# EAGLE schematic shige7seg_earring (EAGLE 9.4.1)
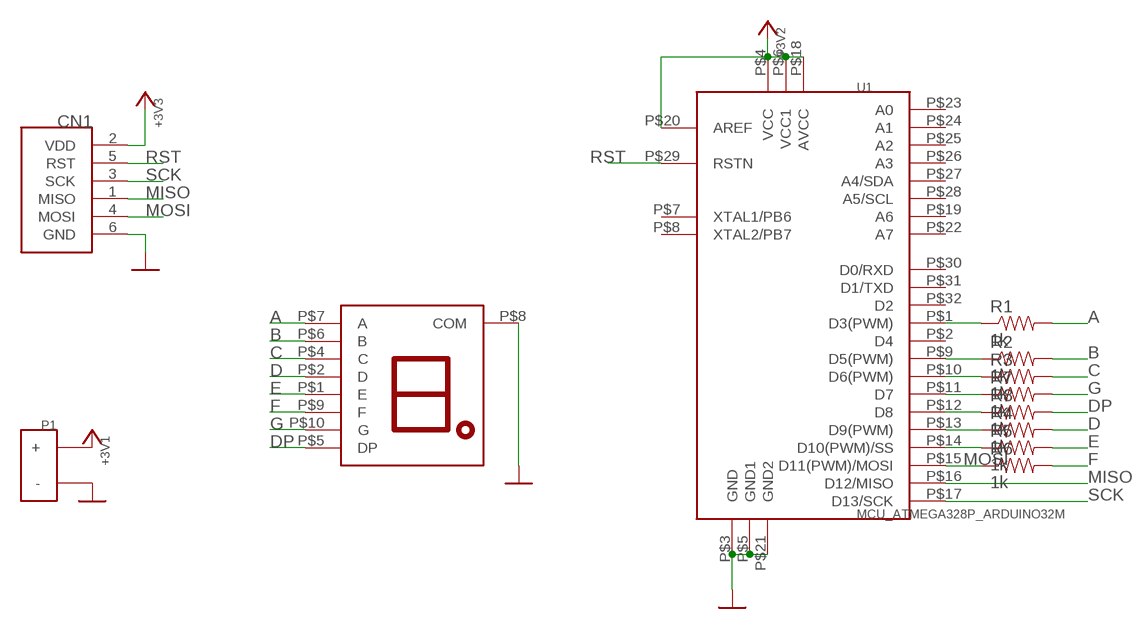
[diagram p0: schematic, sheet 1]

## Parts
CN1  CON_AVRISPTH  [2X03R]
D1  LED_7SEG  [7SEG_10X7SMD]
P1  BATTERYCOIN1220  [BAT_CR1220_SMD]
R1  1k  RES0603  [0603]
R2  1k  RES0603  [0603]
R3  1k  RES0603  [0603]
R4  1k  RES0603  [0603]
R5  1k  RES0603  [0603]
R6  1k  RES0603  [0603]
R7  1k  RES0603  [0603]
R8  1k  RES0603  [0603]
U1  MCU_ATMEGA328P_ARDUINO32M  [QFN32]

## Nets
+3V3: CN1.2(VDD) P1.P(+) U1.P$4(VCC) U1.P$6(VCC1) U1.P$18(AVCC) U1.P$20(AREF) ; supply symbol labelled POW_+3V3
A: D1.P$7(A) R1.2
B: D1.P$6(B) R2.2
C: D1.P$4(C) R3.2
D: D1.P$2(D) R4.2
DP: D1.P$5(DP) R8.2
E: D1.P$1(E) R5.2
F: D1.P$9(F) R6.2
G: D1.P$10(G) R7.2
GND: CN1.6(GND) D1.P$8(COM) P1.M(-) U1.P$3(GND) U1.P$5(GND1) U1.P$21(GND2) ; supply symbol labelled POW_GND
MISO: CN1.1(MISO) U1.P$16(D12/MISO)
MOSI: CN1.4(MOSI) R6.1 U1.P$15(D11(PWM)/MOSI)
N$1: R1.1 U1.P$1(D3(PWM))
N$2: R2.1 U1.P$9(D5(PWM))
N$3: R3.1 U1.P$10(D6(PWM))
N$4: R7.1 U1.P$11(D7)
N$5: R8.1 U1.P$12(D8)
N$6: R4.1 U1.P$13(D9(PWM))
N$7: R5.1 U1.P$14(D10(PWM)/SS)
RST: CN1.5(RST) U1.P$29(RSTN)
SCK: CN1.3(SCK) U1.P$17(D13/SCK)
Unconnected: U1.P$2(D4) U1.P$7(XTAL1/PB6) U1.P$8(XTAL2/PB7) U1.P$19(A6) U1.P$22(A7) U1.P$23(A0) U1.P$24(A1) U1.P$25(A2) U1.P$26(A3) U1.P$27(A4/SDA) U1.P$28(A5/SCL) U1.P$30(D0/RXD) U1.P$31(D1/TXD) U1.P$32(D2)

## Library data of the parts
CN1 = akita:CON_AVRISP: AVR ISP standard 2x3 connector
D1 = akita:LED_7SEG: 7segment LED
P1 = akita:BATTERY: general battery connector
R1-R8 = akita:RES: Resistor Basic schematic elements and footprints for 0603, 1206, and PTH resistors.
U1 = akita:MCU_ATMEGA328P_ARDUINO: ATmega328P with Arduino's pin assignment